# EAGLE design LED_BLINK (EAGLE 7.3.0)
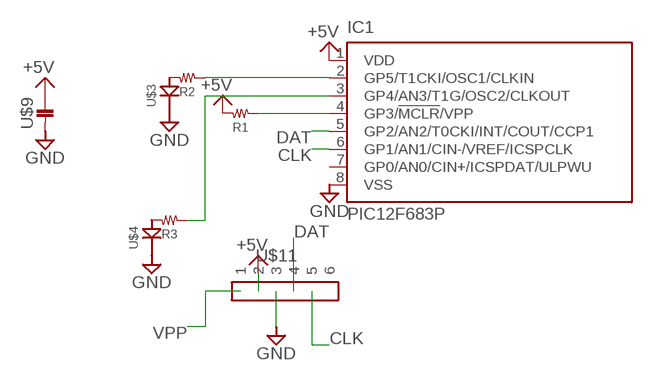
[diagram p0: schematic, sheet 1]

## Parts
IC1  PIC12F683P  [DIL8]
R1  RESISTOR_1/8  [1/8R]
R2  RESISTOR_1/8  [1/8R]
R3  RESISTOR_1/8  [1/8R]
U$3  5MMLED  [5MM]
U$4  5MMLED  [5MM]
U$9  1608  [1608]
U$11  PIN_HEADER_6  [PIN_HEADER_6]

## Nets
+5V: IC1.1(VDD) R1.P$2 U$9.P$1 U$11.2
CLK: IC1.6(GP1/AN1/CIN-/VREF/ICSPCLK) U$11.5
DAT: IC1.5(GP2/AN2/T0CKI/INT/COUT/CCP1) U$11.4
GND: IC1.8(VSS) U$3.K U$4.K U$9.P$2 U$11.3
N$1: R2.P$2 U$3.A
N$2: R3.P$2 U$4.A
N$3: IC1.2(GP5/T1CKI/OSC1/CLKIN) R2.P$1
N$5: IC1.3(GP4/AN3/T1G/OSC2/CLKOUT) R3.P$1
VPP: IC1.4(GP3/!MCLR!/VPP) R1.P$1 U$11.1
Unconnected: IC1.7(GP0/AN0/CIN+/ICSPDAT/ULPWU) U$11.6

## Library data of the parts
IC1 = microchip:PIC12F683: 8-Pin Flash-Based, 8-Bit CMOS Microcontrollers with nanoWatt Technology Source: http://ww1.microchip.com/downloads/en/DeviceDoc/41211D_.pdf; MF: MICROCHIP; MPN: PIC12F683-I/P; OC_FARNELL: 9759034; OC_NEWARK: 89H0442
R1-R3 = 01_R:RESISTOR_1/8
U$3 U$4 = 10_LED:5MMLED
U$9 = 02_C:1608
U$11 = 08_CONECTOR:PIN_HEADER_6

## Board
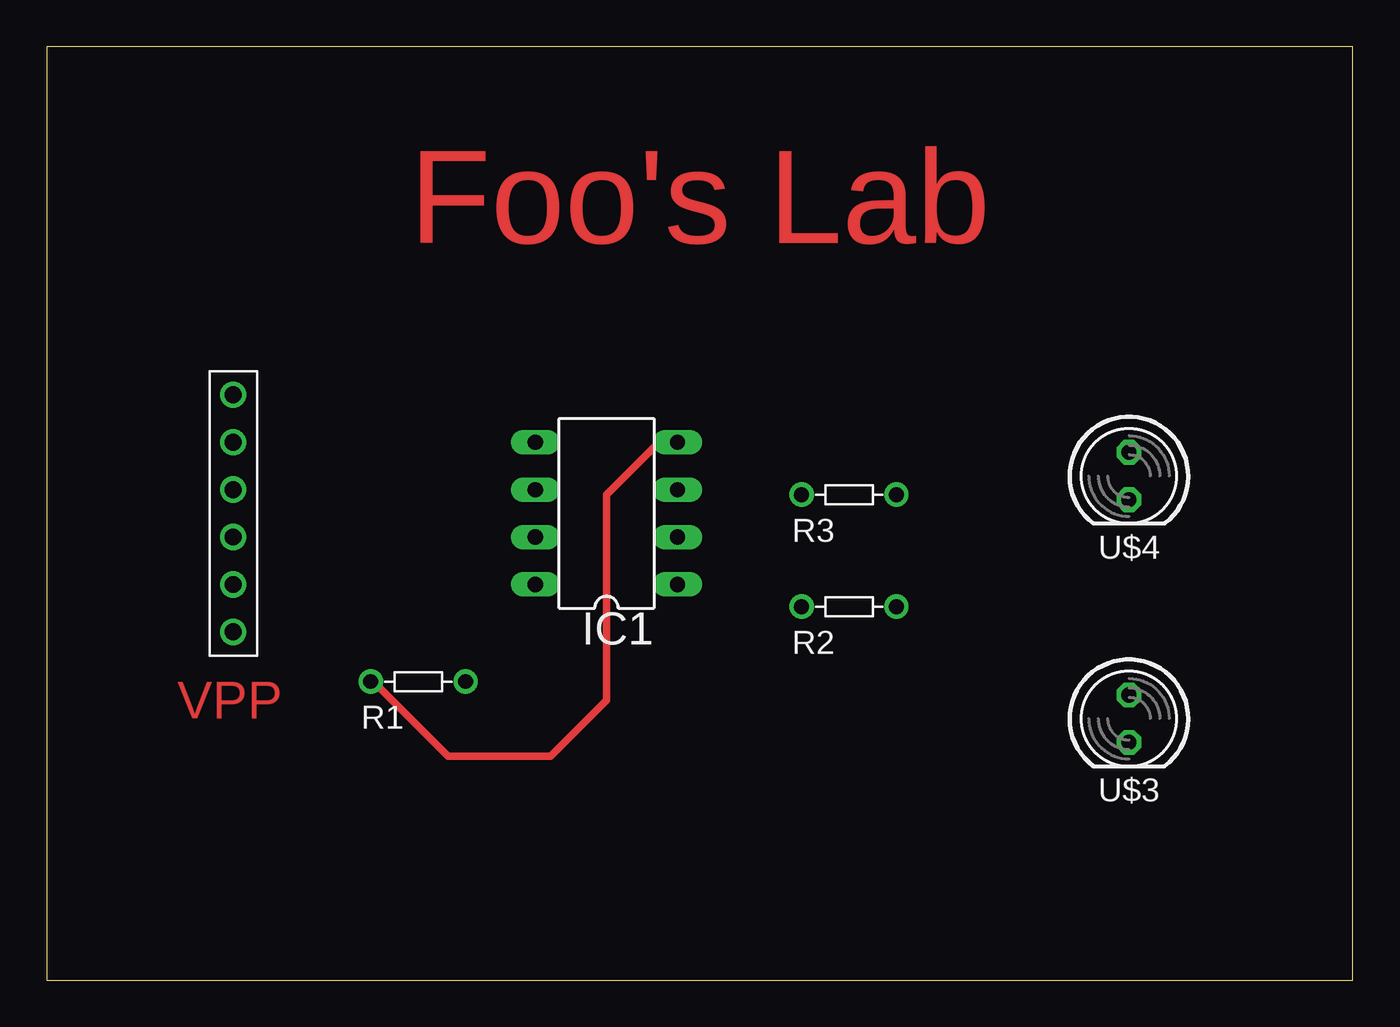
[diagram p1: board, top side]
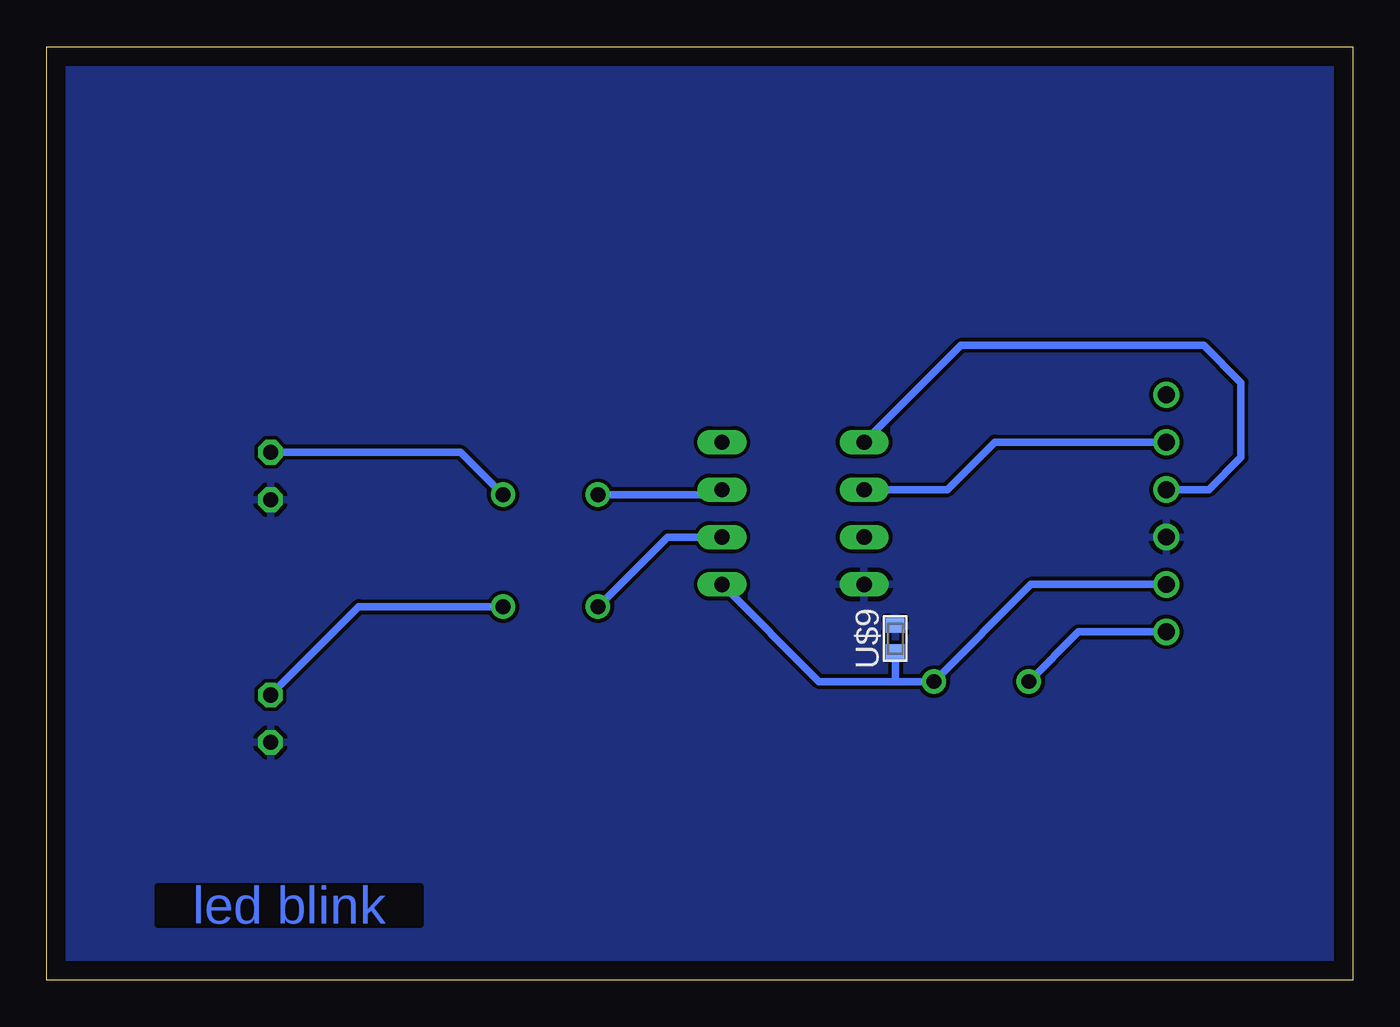
[diagram p2: board, bottom side, seen from below]

Size 70 x 50 mm. Coordinates in mm from the lower left corner, seen from the top.
Outline: 0,0 70,0 70,50 0,50 0,0
Copper layers (1*16): Top 0.035mm / dielectric 1.5mm / Bottom 0.035mm
Design rules "default": minimum track width 10mil, minimum drill 24mil, track to track 8mil, track to pad 8mil, pad to pad 8mil, via to via 8mil, smd to smd 8mil, copper to edge 40mil, drill to drill 8mil, minimum pad ring 10mil, minimum via ring 8mil, stop-mask expansion 4mil, vias tented up to drill 0mil, thermal gap 10mil

### Footprints (pad centres in the part's own frame; a part is rotated, then mirrored left to right if it is on the bottom)
DIL8 = drill 0.813 long: 1 -3.81,-3.81; 2 -1.27,-3.81; 3 1.27,-3.81; 4 3.81,-3.81; 5 3.81,3.81; 6 1.27,3.81; 7 -1.27,3.81; 8 -3.81,3.81
1/8R = drill 0.8: P$1 -2.54,0; P$2 2.54,0
5MM = drill 0.813 octagon: A 0,-1.27; K 0,1.27
1608 = smd 0.8 x 1: P$1 -0.7,0; P$2 0.7,0
PIN_HEADER_6 = drill 0.9: 1 -6.35,0; 2 -3.81,0; 3 -1.27,0; 4 1.27,0; 5 3.81,0; 6 6.35,0

### Placement (x,y rotation side)
IC1  30,25 90 top
R1  19.91,15.99 0 top
R2  43,20 0 top
R3  43,26 0 top
U$3  58,14 180 top
U$4  58,27 180 top
U$9  24.52,18.29 90 bottom
U$11  10,25 90 top

### Tracks (layer width: path | path; a pad name or v marks a point on that pad's centre or on a via)
+5V
  Bottom 0.406: 24.5,15.99 R1.P$2 17.25,21.19 U$11.2 | 24.5,15.99 28.61,15.99 IC1.1 | U$9.P$1 24.52,16.01 24.5,15.99
CLK
  Bottom 0.406: IC1.6 21.73,26.27 19.19,28.81 U$11.5
DAT
  Bottom 0.406: U$11.4 7.73,26.27 6,28 6,32 8,34 21,34 IC1.5
GND
  pour Bottom (rank 2): 0,50 70,50 70,0 0,0
N$1
  Bottom 0.406: U$3.A 53.27,20 R2.P$2
N$2
  Bottom 0.406: R3.P$2 47.81,28.27 U$4.A
N$3
  Bottom 0.406: R2.P$1 36.73,23.73 IC1.2
N$4
  pour Bottom (isolate 1): 49,5.5 65,5.5 65,2.5 49,2.5
N$5
  Bottom 0.406: IC1.3 34.08,26 R3.P$1
VPP
  Top 0.406: R1.P$1 17.51,15.99 21.5,12 27,12 30,15 30,26 32.81,28.81 IC1.4
  Bottom 0.406: R1.P$1 14.71,18.65 U$11.1

### Text on the board
Top: Foo's Lab | VPP
Bottom: led blink